# Altium project SKY32B750_OSPI_EVB1_V3.1.PrjPcb
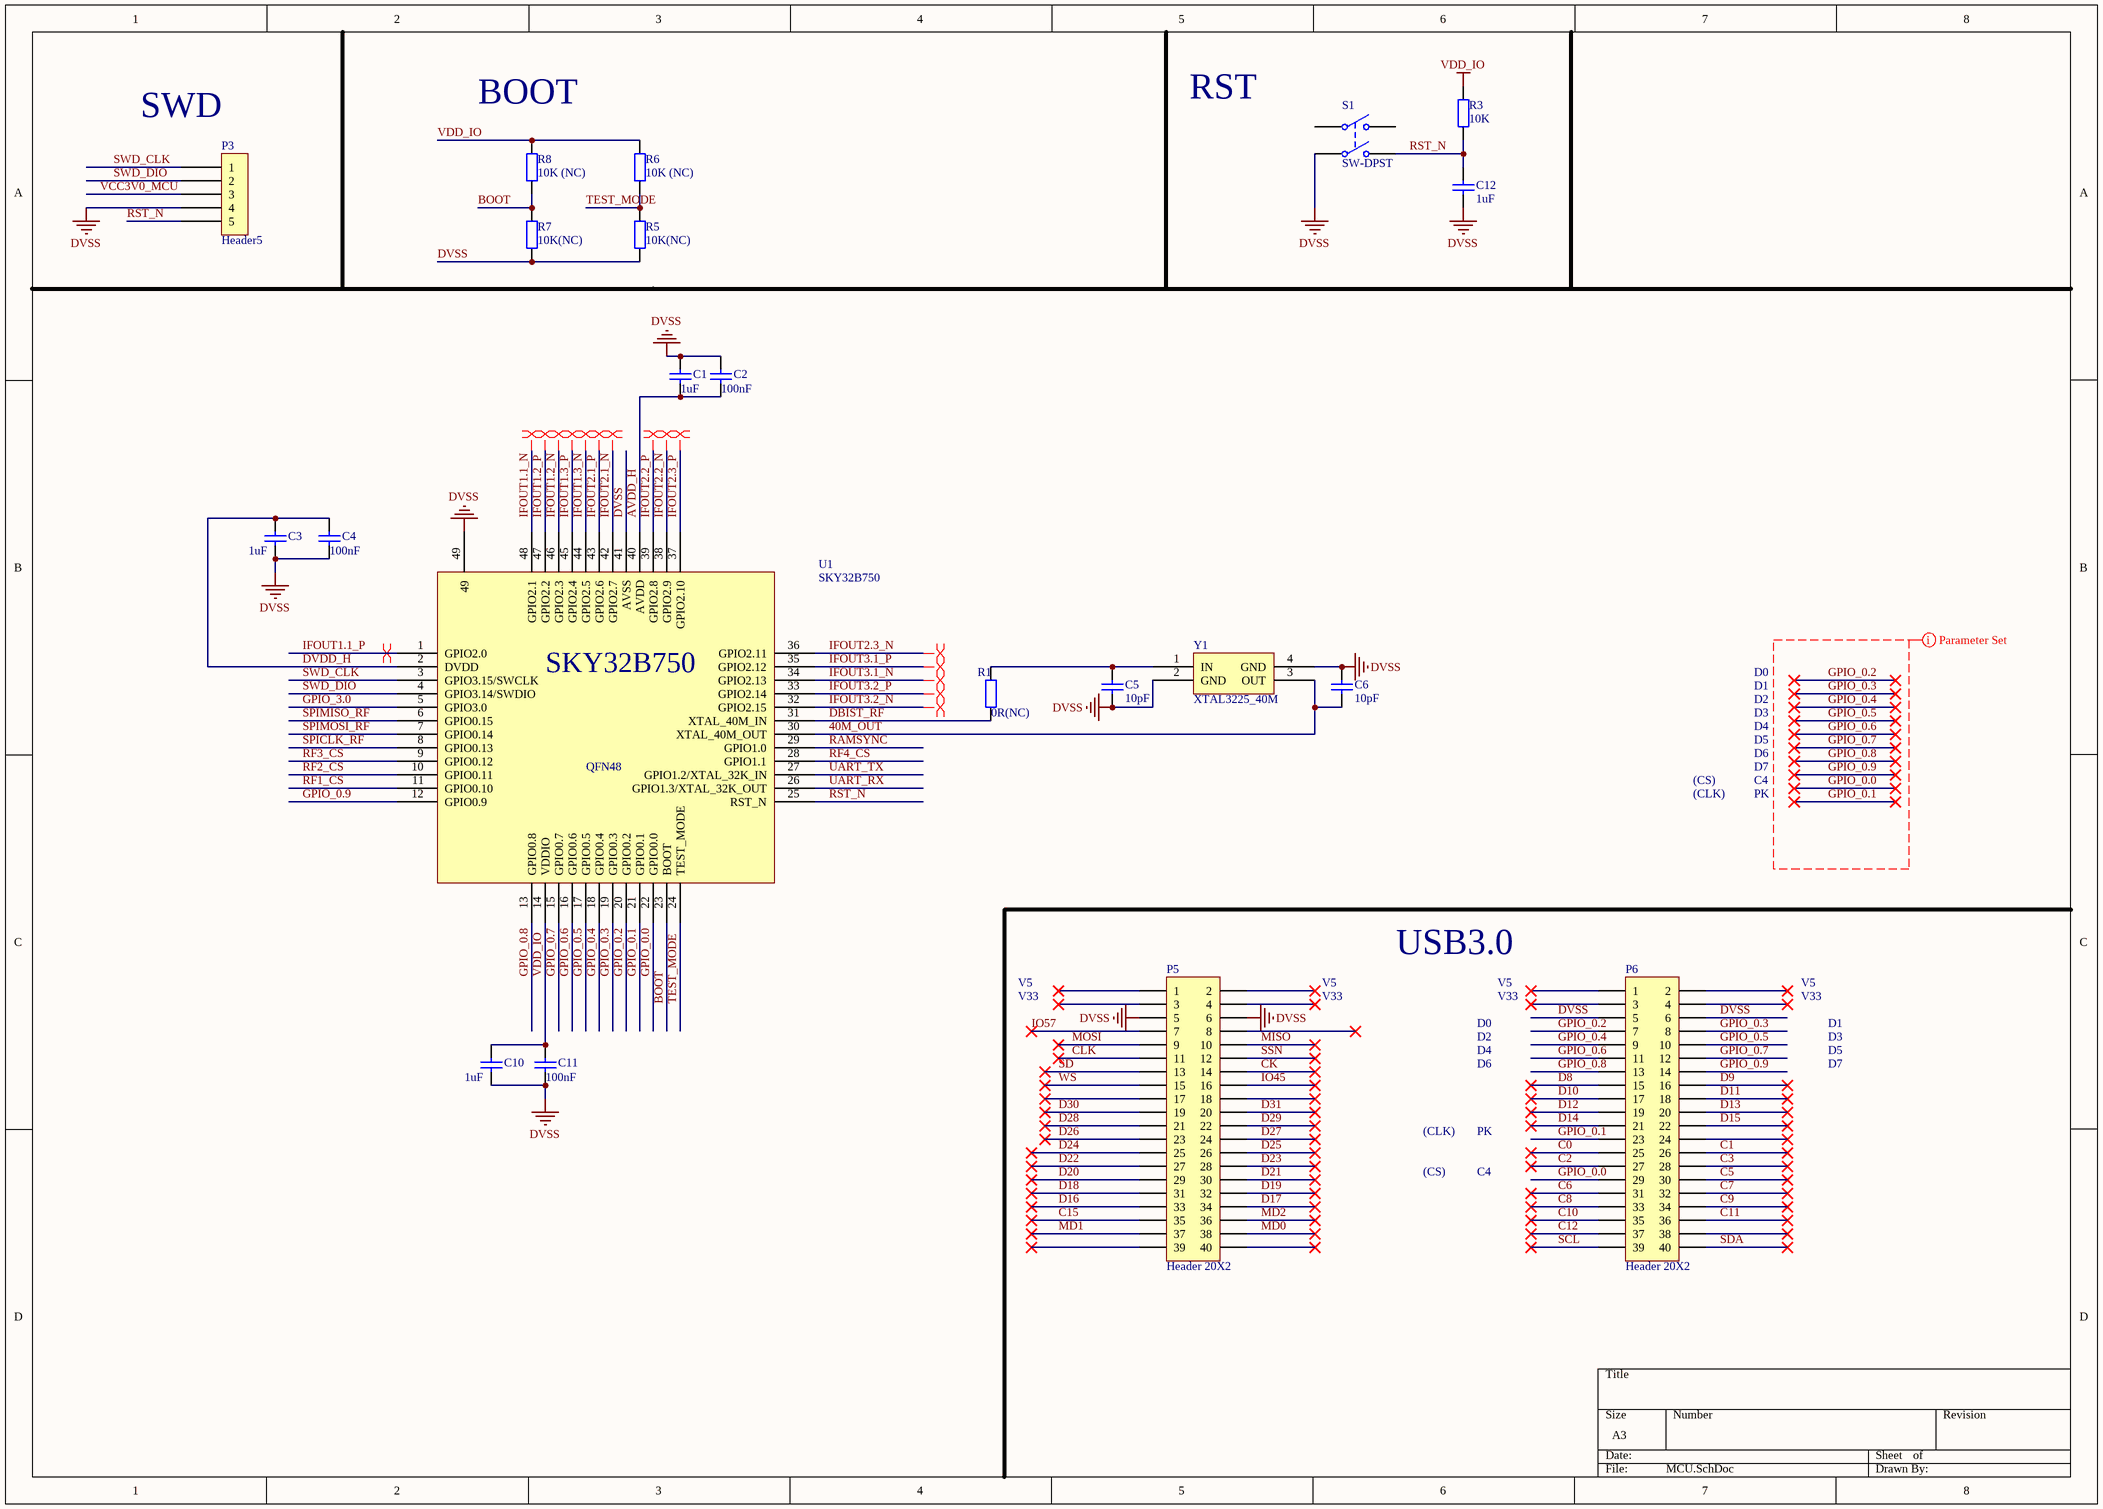
[diagram p0: MCU.SchDoc]
3 sheets, 94 parts. Net scope: global (net labels, ports and power ports of the same name join across sheets).
Board file: SKY32B750_OSPI_EVB1_V3.1.PcbDoc
Sheets:
  MCU.SchDoc
  Power.SchDoc
  RF_Connect.SchDoc

## Sheet MCU.SchDoc
size A3; SheetNumber: 1; SheetTotal: 3

### Parts
C1  1uF  [R0603]
C2  100nF  [R0603]
C3  1uF  [R0603]
C4  100nF  [R0603]
C5  10pF  [R0603]
C6  10pF  [R0603]
C10  1uF  [R0603]
C11  100nF  [R0603]
C12  1uF  [R0603]
P3  Header5  [HDR1X5]
P5  Header 20X2  [2X20_2_54_SMD]
P6  Header 20X2  [2X20_2_54_SMD]
R1  0R(NC)  [R0603]
R3  10K  [R0603]
R5  10K(NC)  [R0603]
R6  10K (NC)  [R0603]
R7  10K(NC)  [R0603]
R8  10K (NC)  [R0603]
S1  SW-DPST  [sw]
U1  SKY32B750  [QFN48]
Y1  XTAL3225_40M  [XTAL-3225]

### Nets
DVSS: C1.2 C2.2 C3.1 C4.1 C5.2 C6.1 C10.1 C11.1 C12.1 P3.4 P5.5 P5.6 P6.5 P6.6 R5.2 R7.2 S1.3(COMMON2) U1.41(AVSS) U1.49 Y1.2(GND) Y1.4(GND)
VCC3V0_MCU: P3.3
VDD_IO: C10.2 C11.2 R3.2 R6.1 R8.1 U1.14(VDDIO)
40M_OUT: C6.2 U1.30(XTAL_40M_OUT) Y1.3(OUT)
AVDD_H: C1.1 C2.1 U1.40(AVDD)
BOOT: R7.1 R8.2 U1.23(BOOT)
C0: P6.25
C1: P6.26
C2: P6.27
C3: P6.28
C5: P6.30
C6: P6.31
C7: P6.32
C8: P6.33
C9: P6.34
C10: P6.35
C11: P6.36
C12: P6.37
C15: P5.35
CK: P5.14
CLK: P5.11
D8: P6.15
D9: P6.16
D10: P6.17
D11: P6.18
D12: P6.19
D13: P6.20
D14: P6.21
D15: P6.22
D16: P5.33
D17: P5.34
D18: P5.31
D19: P5.32
D20: P5.29
D21: P5.30
D22: P5.27
D23: P5.28
D24: P5.25
D25: P5.26
D26: P5.23
D27: P5.24
D28: P5.21
D29: P5.22
D30: P5.19
D31: P5.20
DBIST_RF: R1.1 U1.31(XTAL_40M_IN)
DVDD_H: C3.2 C4.2 U1.2(DVDD)
GPIO_0.0: P6.29 U1.22(GPIO0.0)
GPIO_0.1: P6.23 U1.21(GPIO0.1)
GPIO_0.2: P6.7 U1.20(GPIO0.2)
GPIO_0.3: P6.8 U1.19(GPIO0.3)
GPIO_0.4: P6.9 U1.18(GPIO0.4)
GPIO_0.5: P6.10 U1.17(GPIO0.5)
GPIO_0.6: P6.11 U1.16(GPIO0.6)
GPIO_0.7: P6.12 U1.15(GPIO0.7)
GPIO_0.8: P6.13 U1.13(GPIO0.8)
GPIO_0.9: P6.14 U1.12(GPIO0.9)
GPIO_3.0: U1.5(GPIO3.0)
IFOUT1.1_N: U1.48(GPIO2.1)
IFOUT1.1_P: U1.1(GPIO2.0)
IFOUT1.2_N: U1.46(GPIO2.3)
IFOUT1.2_P: U1.47(GPIO2.2)
IFOUT1.3_N: U1.44(GPIO2.5)
IFOUT1.3_P: U1.45(GPIO2.4)
IFOUT2.1_N: U1.42(GPIO2.7)
IFOUT2.1_P: U1.43(GPIO2.6)
IFOUT2.2_N: U1.38(GPIO2.9)
IFOUT2.2_P: U1.39(GPIO2.8)
IFOUT2.3_N: U1.36(GPIO2.11)
IFOUT2.3_P: U1.37(GPIO2.10)
IFOUT3.1_N: U1.34(GPIO2.13)
IFOUT3.1_P: U1.35(GPIO2.12)
IFOUT3.2_N: U1.32(GPIO2.15)
IFOUT3.2_P: U1.33(GPIO2.14)
IO45: P5.16
IO57: P5.7
MD0: P5.38
MD1: P5.37
MD2: P5.36
MISO: P5.10
MOSI: P5.9
RAMSYNC: U1.29(GPIO1.0)
RF1_CS: U1.11(GPIO0.10)
RF2_CS: U1.10(GPIO0.11)
RF3_CS: U1.9(GPIO0.12)
RF4_CS: U1.28(GPIO1.1)
RST_N: C12.2 P3.5 R3.1 S1.4(NO2) U1.25(RST_N)
SCL: P6.39
SD: P5.13
SDA: P6.40
SPICLK_RF: U1.8(GPIO0.13)
SPIMISO_RF: U1.6(GPIO0.15)
SPIMOSI_RF: U1.7(GPIO0.14)
SSN: P5.12
SWD_CLK: P3.1 U1.3(GPIO3.15/SWCLK)
SWD_DIO: P3.2 U1.4(GPIO3.14/SWDIO)
TEST_MODE: R5.1 R6.2 U1.24(TEST_MODE)
UART_RX: U1.26(GPIO1.3/XTAL_32K_OUT)
UART_TX: U1.27(GPIO1.2/XTAL_32K_IN)
WS: P5.15
NetC5_1: C5.1 R1.2 Y1.1(IN)

Not connected (* = marked no-connect by the designer): P5 1* 2* 3* 4* 8* 17* 18* 39* 40*; P6 1* 2* 3* 4* 24* 38*; S1 1(COMMON1) 2(NO1)

### Layout directives
differential pair: IFOUT1.1_N, IFOUT1.1_P, IFOUT1.2_N, IFOUT1.2_P, IFOUT1.3_N, IFOUT1.3_P, IFOUT2.1_N, IFOUT2.1_P, IFOUT2.2_N, IFOUT2.2_P, IFOUT2.3_N, IFOUT2.3_P, IFOUT3.1_N, IFOUT3.1_P, IFOUT3.2_N, IFOUT3.2_P
net class OSPI: GPIO_0.0, GPIO_0.1, GPIO_0.2, GPIO_0.3, GPIO_0.4, GPIO_0.5, GPIO_0.6, GPIO_0.7, GPIO_0.8, GPIO_0.9

### Notes on the sheet
- (near R8) BOOT
- RST
- (near P3) SWD
- D0
- D1
- D2
- D3
- (CS)
- D4
- D5
- D6
- D7
- C4
- (CLK)
- PK
- V5
- USB3.0
- V33
- (in symbol SYK32B750) QFN48

### Library data of the parts
C1-C4 C10 C11 = Cap: CAP, CERM, 4.7nF, 100 V, +/- 5%, X7R, 0603; Value: 100pF; Published: 8-Jun-2000; LatestRevisionDate: 17-Jul-2002; LatestRevisionNote: Re-released for DXP Platform.; PackageReference: RAD-0.3; Publisher: Altium Limited
C5 C6 C12 = Cap: Capacitor; Published: 8-Jun-2000; LatestRevisionDate: 17-Jul-2002; LatestRevisionNote: Re-released for DXP Platform.; PackageReference: RAD-0.3; Publisher: Altium Limited; PackageDescription: Radial Cap, Thru-Hole; 2 Leads; 0.3 in Pin Spacing
  C5 C6: Value: 10pF
  C12: Value: 1uF
P5 P6 = Header 20X2: Header, 20-Pin, Dual row; LatestRevisionDate: 17-Jul-2002; LatestRevisionNote: Re-released for DXP Platform.; Publisher: Altium Limited
R1 R3 = Res2: Resistor; Published: 8-Jun-2000; LatestRevisionDate: 17-Jul-2002; LatestRevisionNote: Re-released for DXP Platform.; PackageReference: AXIAL-0.4; Publisher: Altium Limited; PackageDescription: Axial Device, Thru-Hole; 2 Leads; 0.4 in Pin Spacing
  R1: Value: 0R
  R3: Value: 10K
R5-R8 = Res2: Resistor; Value: 0R; Published: 8-Jun-2000; LatestRevisionDate: 17-Jul-2002; LatestRevisionNote: Re-released for DXP Platform.; PackageReference: AXIAL-0.4; Publisher: Altium Limited; PackageDescription: Axial Device, Thru-Hole; 2 Leads; 0.4 in Pin Spacing
S1 = SW-DPST: Double-Pole, Single-Throw Switch; Published: 24-Mar-1999; LatestRevisionDate: 17-Jul-2002; LatestRevisionNote: Re-released for DXP Platform.; PackageReference: DPST-4; Publisher: Altium Limited; PackageDescription: Switch; 4 Leads
U1 = SYK32B750
Y1 = XTAL3225

## Sheet Power.SchDoc
size A4; SheetNumber: 2; SheetTotal: 3
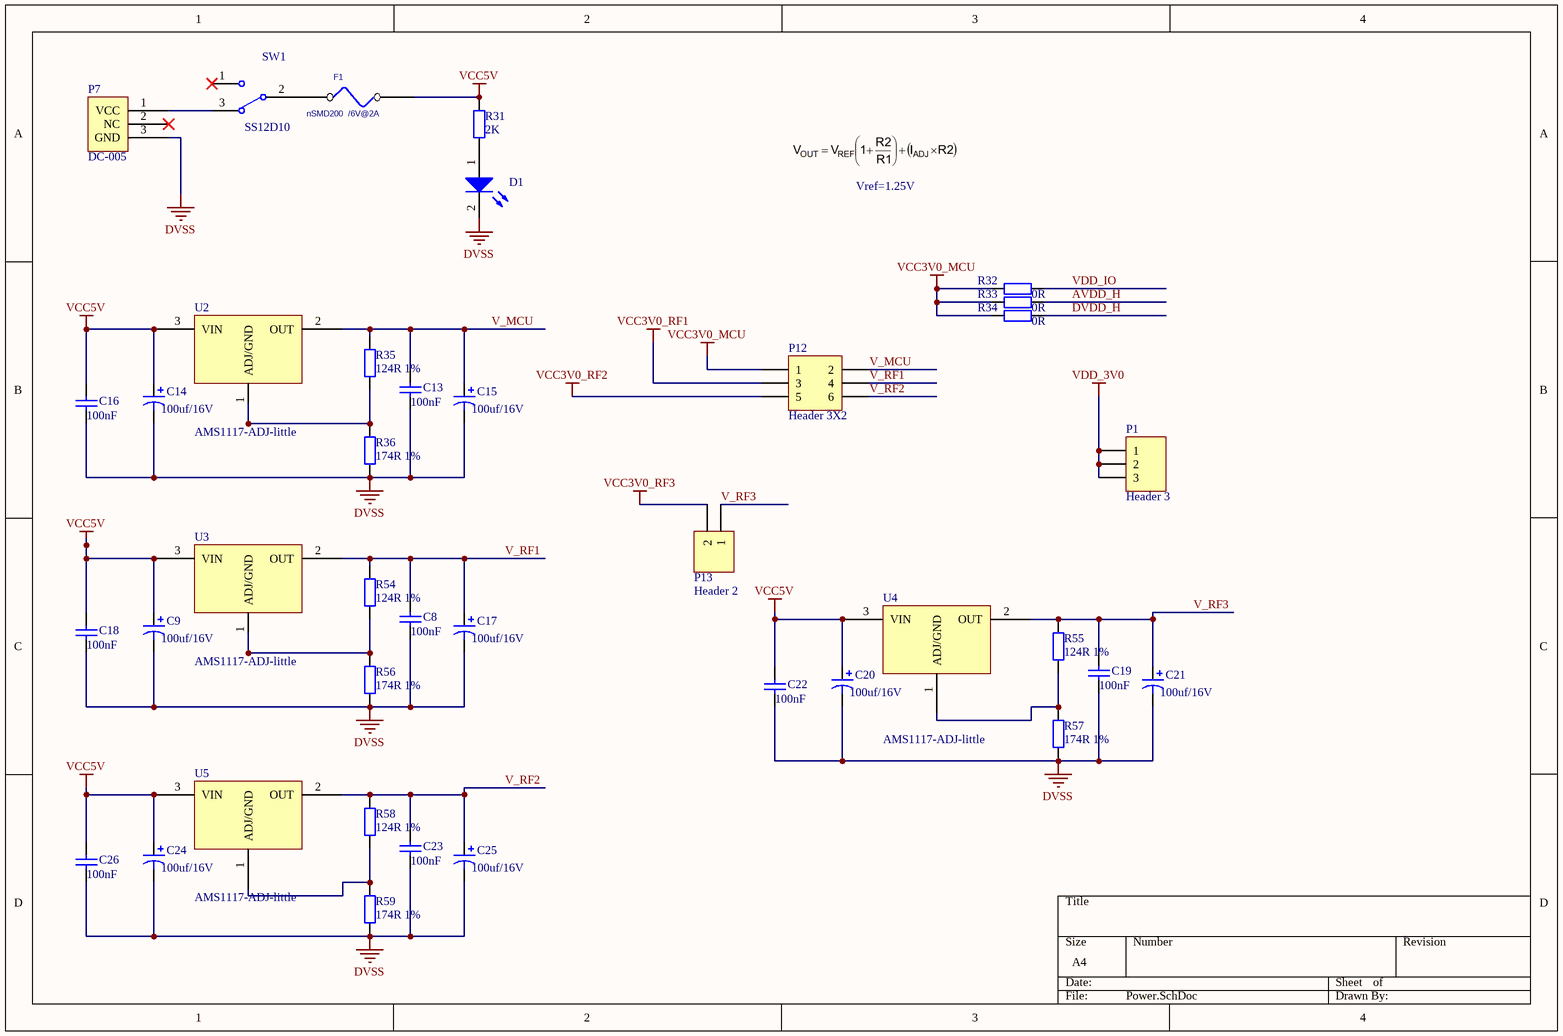
[diagram p1: Power.SchDoc]

### Parts
C8  100nF  [R0603]
C9  100uf/16V  [TAN3528]
C13  100nF  [R0603]
C14  100uf/16V  [TAN3528]
C15  100uf/16V  [TAN3528]
C16  100nF  [R0603]
C17  100uf/16V  [TAN3528]
C18  100nF  [R0603]
C19  100nF  [R0603]
C20  100uf/16V  [TAN3528]
C21  100uf/16V  [TAN3528]
C22  100nF  [R0603]
C23  100nF  [R0603]
C24  100uf/16V  [TAN3528]
C25  100uf/16V  [TAN3528]
C26  100nF  [R0603]
D1  LED_Red  [0603d]  (value not drawn)
F1  nSMD200  /6V@2A  [FN1812]
P1  Header 3  [HDR1X3]
P7  DC-005  [DC005]
P12  Header 3X2  [HDR2X3]
P13  Header 2  [HDR1X2]
R31  2K  [R0603]
R32  0R  [R0603]
R33  0R  [R0603]
R34  0R  [R0603]
R35  124R 1%  [R0603]
R36  174R 1%  [R0603]
R54  124R 1%  [R0603]
R55  124R 1%  [R0603]
R56  174R 1%  [R0603]
R57  174R 1%  [R0603]
R58  124R 1%  [R0603]
R59  174R 1%  [R0603]
SW1  SS12D10  [SW123]
U2  AMS1117-ADJ-little  [LDO-SOT-89-3]
U3  AMS1117-ADJ-little  [LDO-SOT-89-3]
U4  AMS1117-ADJ-little  [LDO-SOT-89-3]
U5  AMS1117-ADJ-little  [LDO-SOT-89-3]

### Nets
DVSS: C8.1 C9.2 C13.1 C14.2 C15.2 C16.1 C17.2 C18.1 C19.1 C20.2 C21.2 C22.1 C23.1 C24.2 C25.2 C26.1 D1.2(K) P7.3(GND) R36.1 R56.1 R57.1 R59.1
VCC3V0_MCU: P12.1 R32.1 R33.1 R34.1
VCC3V0_RF1: P12.3
VCC3V0_RF2: P12.5
VCC3V0_RF3: P13.2
VCC5V: C9.1 C14.1 C16.2 C18.2 C20.1 C22.2 C24.1 C26.2 F1.2 R31.1 U2.3(VIN) U3.3(VIN) U4.3(VIN) U5.3(VIN)
VDD_3V0: P1.1 P1.2 P1.3
VDD_IO: R32.2
AVDD_H: R33.2
DVDD_H: R34.2
V_MCU: C13.2 C15.1 P12.2 R35.2 U2.2(OUT)
V_RF1: C8.2 C17.1 P12.4 R54.2 U3.2(OUT)
V_RF2: C23.2 C25.1 P12.6 R58.2 U5.2(OUT)
V_RF3: C19.2 C21.1 P13.1 R55.2 U4.2(OUT)
NetD1_1: D1.1(A) R31.2
NetF1_1: F1.1 SW1.2
NetP7_1: P7.1(VCC) SW1.3
NetR35_1: R35.1 R36.2 U2.1(ADJ/GND)
NetR54_1: R54.1 R56.2 U3.1(ADJ/GND)
NetR55_1: R55.1 R57.2 U4.1(ADJ/GND)
NetR58_1: R58.1 R59.2 U5.1(ADJ/GND)

Not connected (* = marked no-connect by the designer): P7 2(NC)*; SW1 1*

### Notes on the sheet
- Vref=1.25V

### Library data of the parts
C8 C13 C16 C18 C19 C22 C23 C26 = Cap: Value: 100pF; Published: 8-Jun-2000; LatestRevisionDate: 17-Jul-2002; LatestRevisionNote: Re-released for DXP Platform.; PackageReference: RAD-0.3; Publisher: Altium Limited
C9 C14 C15 C17 C20 C21 C24 C25 = Cap Pol1: tan3528 100uf/16V; Value: 100pF; Published: 8-Jun-2000; LatestRevisionDate: 17-Jul-2002; LatestRevisionNote: Re-released for DXP Platform.; PackageReference: RB7.6-15; Publisher: Altium Limited; PackageDescription: Polarized Capacitor (Radial); 2 Leads
D1 = LED2: Typical RED, GREEN, YELLOW, AMBER GaAs LED; Manufacturer: Generic Components; Class: Optoelectronic; Published: 08/06/2000; Publisher: Altium Hobart Technology Centre; SubClass: LED
F1 = FUSE: MFR_PN: 0603L100SLYR; MFR_Name: LITTELFUSE
P1 = Header 3: Header, 3-Pin; LatestRevisionDate: 17-Jul-2002; LatestRevisionNote: Re-released for DXP Platform.; Publisher: Altium Limited
P13 = Header 2: 2.54mm直插针,2P; LatestRevisionDate: 17-Jul-2002; LatestRevisionNote: Re-released for DXP Platform.; Publisher: Altium Limited
R31-R34 = Res2: Resistor; Manufacturer: Generic Components; Class: Passive; Value: 2.2K; Published: 08/06/2000; Publisher: Altium Hobart Technology Centre; SubClass: Resistor
R35 R36 R54-R59 = Res2: Value: 1K; Published: 8-Jun-2000; LatestRevisionDate: 17-Jul-2002; LatestRevisionNote: Re-released for DXP Platform.; PackageReference: AXIAL-0.4; Publisher: Altium Limited; PackageDescription: Axial Device, Thru-Hole; 2 Leads; 0.4 in Pin Spacing
SW1 = SW123
U2 = AMS1117-ADJ-little: AMS1117-ADJ-little ,SOT-89-3
U3-U5 = AMS1117-ADJ-little: AMS1117-ADJ-little,SOT-89-3

## Sheet RF_Connect.SchDoc
size A3; SheetNumber: 3; SheetTotal: 3
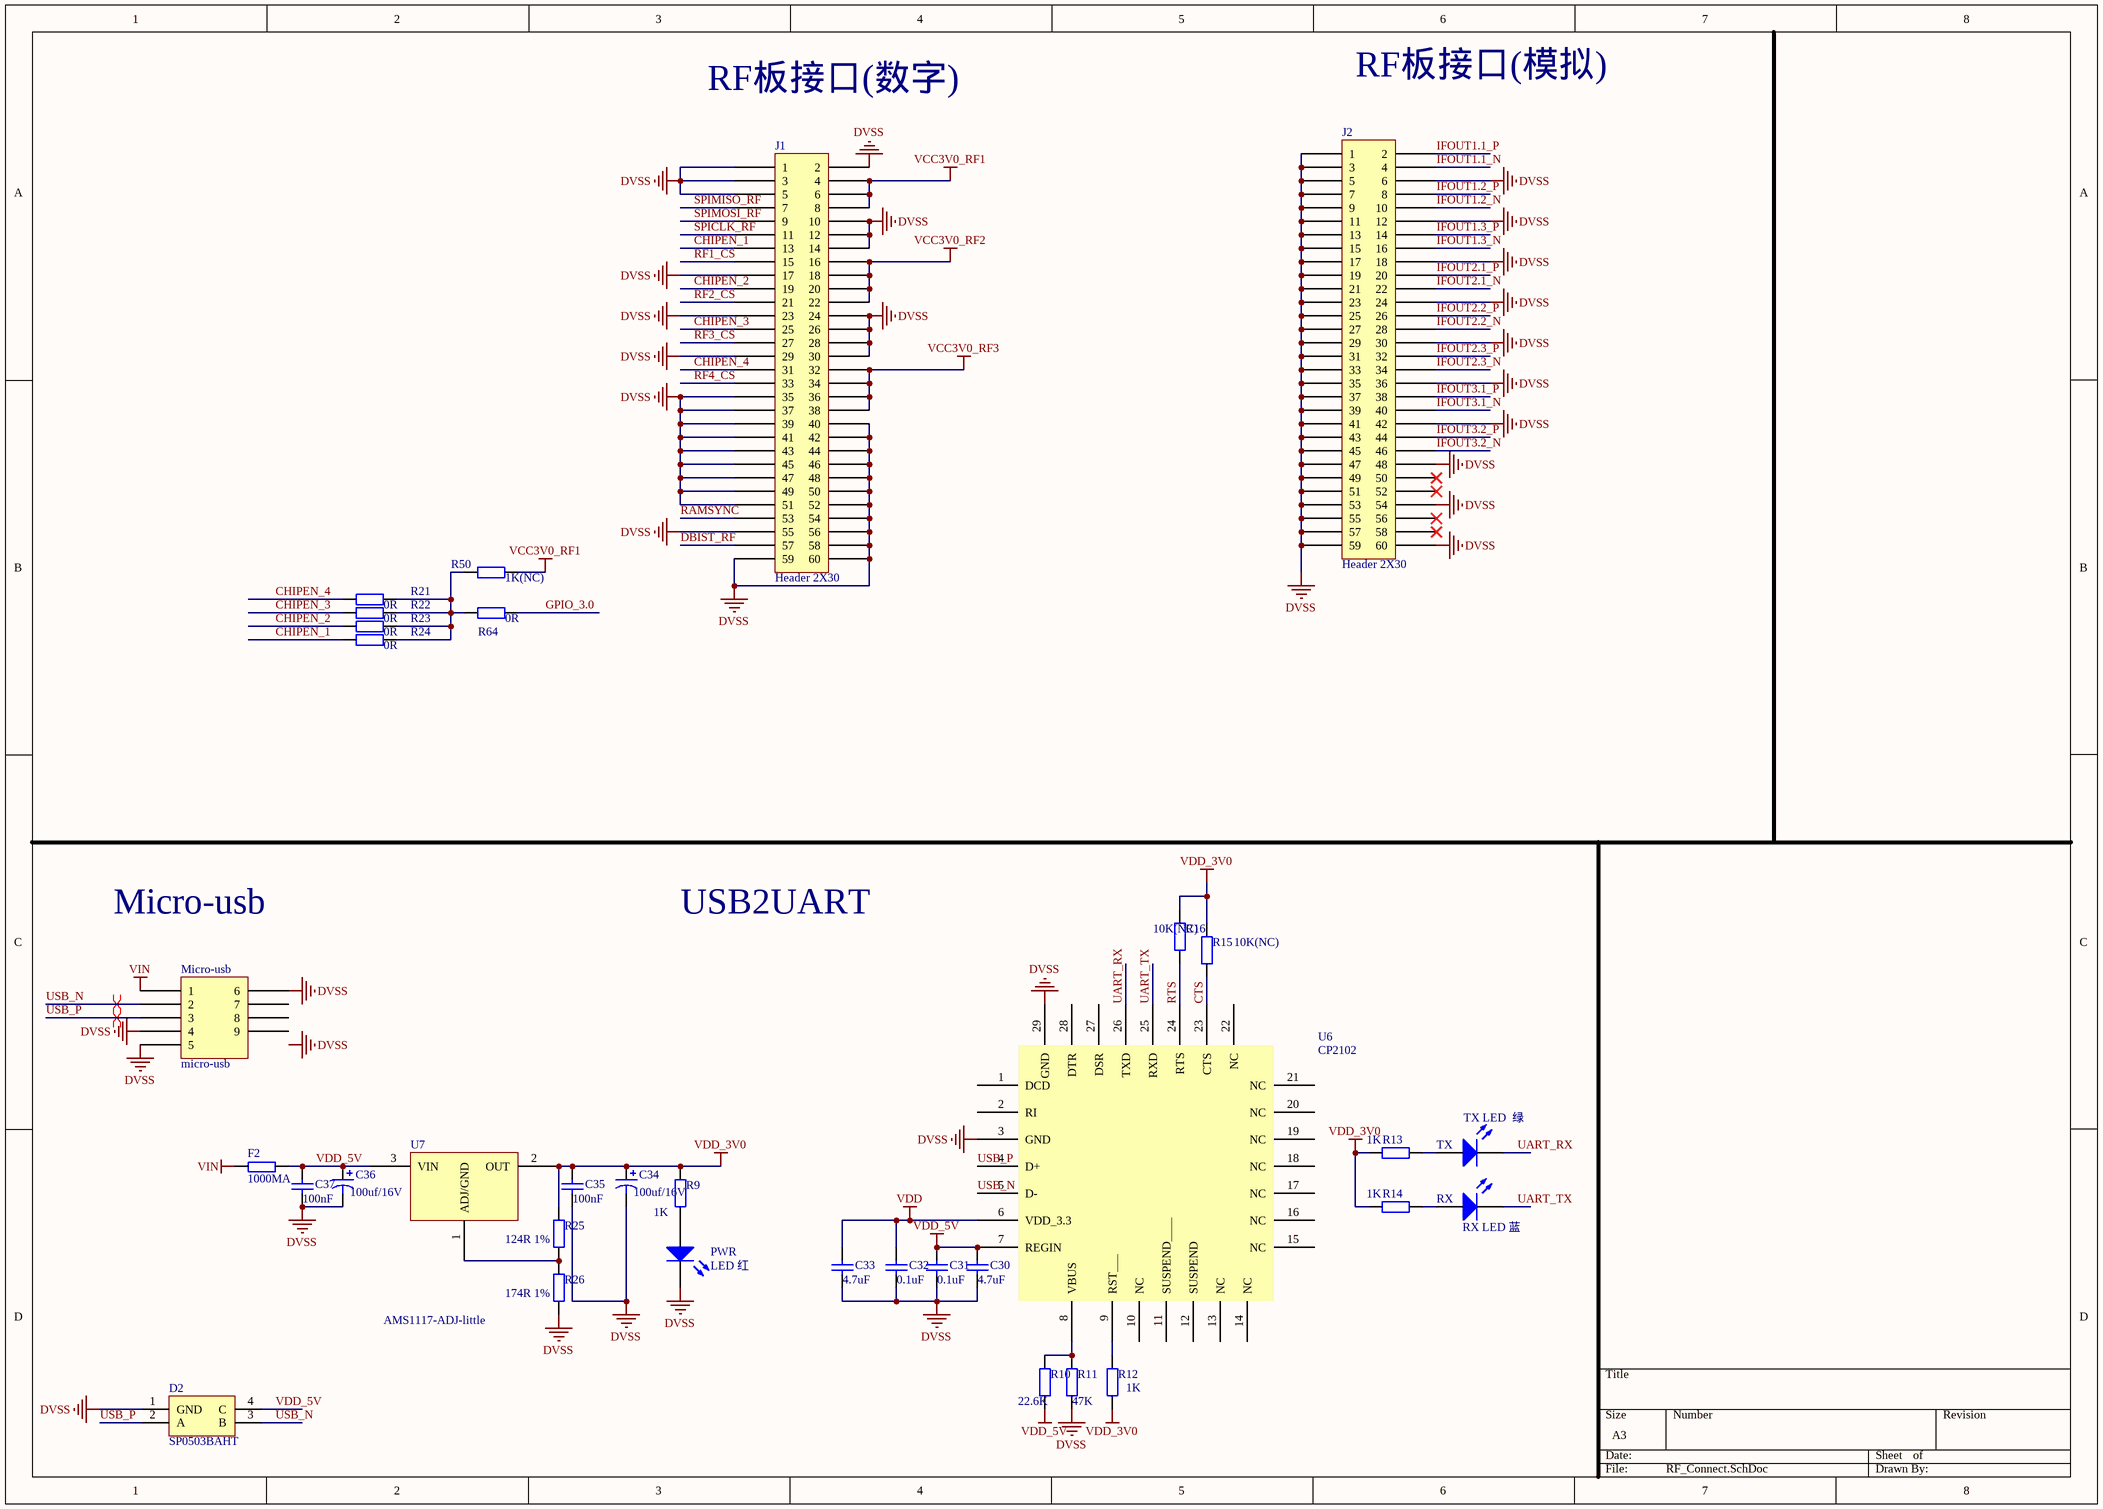
[diagram p2: RF_Connect.SchDoc]

### Parts
C30  4.7uF  [R0603]
C31  0.1uF  [R0603]
C32  0.1uF  [R0603]
C33  4.7uF  [R0603]
C34  100uf/16V  [TAN3528]
C35  100nF  [R0603]
C36  100uf/16V  [TAN3528]
C37  100nF  [R0603]
D2  SP0503BAHT  [SOT143]
F2  1000MA  [0805]
J1  Header 2X30  [60pin_0.8mm]
J2  Header 2X30  [60pin_0.8mm]
Micro-usb  micro-usb  [Micro-B]
PWR  LED 红  [LC-0603_LED_S4]
R9  1K  [R0603]
R10  22.6K  [R0603]
R11  47K  [R0603]
R12  1K  [R0603]
R13  1K  [R0603]
R14  1K  [R0603]
R15  10K(NC)  [R0603]
R16  10K(NC)  [R0603]
R21  0R  [R0603]
R22  0R  [R0603]
R23  0R  [R0603]
R24  0R  [R0603]
R25  124R 1%  [R0603]
R26  174R 1%  [R0603]
R50  1K(NC)  [R0603]
R64  0R  [R0603]
RX  RX LED 蓝  [LC-0603_LED_S4]
TX  TX LED  绿  [LC-0603_LED_S4]
U6  CP2102  [QFN28N5X5P0.5E3.35]
U7  AMS1117-ADJ-little  [LDO-SOT-89-3]

### Nets
DVSS: C30.2 C31.2 C32.2 C33.2 C34.2 C35.1 C36.2 C37.1 D2.1(GND) J1.1 J1.2 J1.3 J1.5 J1.10 J1.12 J1.14 J1.17 J1.23 J1.24 J1.26 J1.28 J1.29 J1.30 J1.35 J1.37 J1.39 J1.40 J1.41 J1.42 J1.43 J1.44 J1.45 J1.46 J1.47 J1.48 J1.49 J1.50 J1.51 J1.52 J1.54 J1.55 J1.56 J1.58 J1.59 J1.60 J2.1 J2.3 J2.5 J2.6 J2.7 J2.9 J2.11 J2.12 J2.13 J2.15 J2.17 J2.18 J2.19 J2.21 J2.23 J2.24 J2.25 J2.27 J2.29 J2.30 J2.31 J2.33 J2.35 J2.36 J2.37 J2.39 J2.41 J2.42 J2.43 J2.45 J2.47 J2.48 J2.49 J2.51 J2.53 J2.54 J2.55 J2.57 J2.59 J2.60 Micro-usb.4 Micro-usb.5 Micro-usb.6 PWR.2(K) R11.2 R26.1 U6.3(GND) U6.29(GND)
VCC3V0_RF1: J1.4 J1.6 J1.8 R50.2
VCC3V0_RF2: J1.16 J1.18 J1.20 J1.22
VCC3V0_RF3: J1.32 J1.34 J1.36 J1.38
VDD: C32.1 C33.1 U6.6(VDD_3.3)
VDD_3V0: C34.1 C35.2 R9.1 R12.2 R13.2 R14.2 R15.1 R16.1 R25.2 U7.2(OUT)
VDD_5V: C30.1 C31.1 C36.1 C37.2 D2.4(C) F2.2 R10.2 U6.7(REGIN) U7.3(VIN)
VIN: F2.1 Micro-usb.1
CHIPEN_1: J1.13 R24.1
CHIPEN_2: J1.19 R23.1
CHIPEN_3: J1.25 R22.1
CHIPEN_4: J1.31 R21.1
CTS: R15.2 U6.23(CTS)
DBIST_RF: J1.57
GPIO_3.0: R64.2
IFOUT1.1_N: J2.4
IFOUT1.1_P: J2.2
IFOUT1.2_N: J2.10
IFOUT1.2_P: J2.8
IFOUT1.3_N: J2.16
IFOUT1.3_P: J2.14
IFOUT2.1_N: J2.22
IFOUT2.1_P: J2.20
IFOUT2.2_N: J2.28
IFOUT2.2_P: J2.26
IFOUT2.3_N: J2.34
IFOUT2.3_P: J2.32
IFOUT3.1_N: J2.40
IFOUT3.1_P: J2.38
IFOUT3.2_N: J2.46
IFOUT3.2_P: J2.44
RAMSYNC: J1.53
RF1_CS: J1.15
RF2_CS: J1.21
RF3_CS: J1.27
RF4_CS: J1.33
RTS: R16.2 U6.24(RTS)
SPICLK_RF: J1.11
SPIMISO_RF: J1.7
SPIMOSI_RF: J1.9
UART_RX: TX.2(K) U6.26(TXD)
UART_TX: RX.2(K) U6.25(RXD)
USB_N: D2.3(B) Micro-usb.2 U6.5(D-)
USB_P: D2.2(A) Micro-usb.3 U6.4(D+)
NetPWR_1: PWR.1(A) R9.2
NetR10_1: R10.1 R11.1 U6.8(VBUS)
NetR12_1: R12.1 U6.9(RST___)
NetR13_1: R13.1 TX.1(A)
NetR14_1: R14.1 RX.1(A)
NetR21_2: R21.2 R22.2 R23.2 R24.2 R50.1 R64.1
NetR25_1: R25.1 R26.2 U7.1(ADJ/GND)

Not connected (* = marked no-connect by the designer): J2 50* 52* 56* 58*; Micro-usb 7 8 9; U6 1(DCD) 2(RI) 10(NC) 11(SUSPEND____) 12(SUSPEND) 13(NC) 14(NC) 15(NC) 16(NC) 17(NC) 18(NC) 19(NC) 20(NC) 21(NC) 22(NC) 27(DSR) 28(DTR)

### Layout directives
differential pair: USB_N, USB_P

### Notes on the sheet
- RF板接口(数字)
- RF板接口(模拟)
- Micro-usb
- USB2UART
- Labels drawn without touching a wire or pin: DVSS

### Library data of the parts
C30-C33 = Cap: 表贴电容; Value: 1uF; Published: 8-Jun-2000; LatestRevisionDate: 17-Jul-2002; LatestRevisionNote: Re-released for DXP Platform.; PackageReference: RAD-0.3; Publisher: Altium Limited
C34 C36 = Cap Pol1: tan3528 100uf/16V; Value: 100pF; Published: 8-Jun-2000; LatestRevisionDate: 17-Jul-2002; LatestRevisionNote: Re-released for DXP Platform.; PackageReference: RB7.6-15; Publisher: Altium Limited; PackageDescription: Polarized Capacitor (Radial); 2 Leads
C35 C37 = Cap: Value: 100pF; Published: 8-Jun-2000; LatestRevisionDate: 17-Jul-2002; LatestRevisionNote: Re-released for DXP Platform.; PackageReference: RAD-0.3; Publisher: Altium Limited
D2 = SP0503BAHT: 表贴芯片
F2 = R_1: 表贴保险
J1 J2 = Header 2X30: 2x30 ， 60P， 0.8mm ，立贴 ，母
Micro-usb = Micro-B
PWR RX TX = LED-SMT: 表贴LED管
R9 R12-R14 = Res2: 表贴电阻; Published: 8-Jun-2000; LatestRevisionDate: 17-Jul-2002; LatestRevisionNote: Re-released for DXP Platform.; PackageReference: AXIAL-0.4; Publisher: Altium Limited; Value: 1K
R10 R11 R15 R16 = Res2: 表贴电阻; Value: 1K; Published: 8-Jun-2000; LatestRevisionDate: 17-Jul-2002; LatestRevisionNote: Re-released for DXP Platform.; PackageReference: AXIAL-0.4; Publisher: Altium Limited
R21-R24 R50 R64 = Res2: as R31 on sheet Power; Published: 08/06/2000; Publisher: Altium Hobart Technology Centre; SubClass: Resistor
R25 R26 = Res2: Value: 1K; Published: 8-Jun-2000; LatestRevisionDate: 17-Jul-2002; LatestRevisionNote: Re-released for DXP Platform.; PackageReference: AXIAL-0.4; Publisher: Altium Limited; PackageDescription: Axial Device, Thru-Hole; 2 Leads; 0.4 in Pin Spacing
U6 = Component_2: 表贴芯片
U7 = AMS1117-ADJ-little: AMS1117-ADJ-little ，SOT-89-3

## Nets that join several sheets
DVSS: MCU (21 pins), Power (22 pins), RF_Connect (93 pins)
VCC3V0_MCU: MCU (P3.3), Power (P12.1 R32.1 R33.1 R34.1)
VCC3V0_RF1: Power (P12.3), RF_Connect (J1.4 J1.6 J1.8 R50.2)
VCC3V0_RF2: Power (P12.5), RF_Connect (J1.16 J1.18 J1.20 J1.22)
VCC3V0_RF3: Power (P13.2), RF_Connect (J1.32 J1.34 J1.36 J1.38)
VDD_3V0: Power (P1.1 P1.2 P1.3), RF_Connect (10 pins)
VDD_IO: MCU (6 pins), Power (R32.2)
AVDD_H: MCU (C1.1 C2.1 U1.40), Power (R33.2)
DBIST_RF: MCU (R1.1 U1.31), RF_Connect (J1.57)
DVDD_H: MCU (C3.2 C4.2 U1.2), Power (R34.2)
GPIO_3.0: MCU (U1.5), RF_Connect (R64.2)
IFOUT1.1_N: MCU (U1.48), RF_Connect (J2.4)
IFOUT1.1_P: MCU (U1.1), RF_Connect (J2.2)
IFOUT1.2_N: MCU (U1.46), RF_Connect (J2.10)
IFOUT1.2_P: MCU (U1.47), RF_Connect (J2.8)
IFOUT1.3_N: MCU (U1.44), RF_Connect (J2.16)
IFOUT1.3_P: MCU (U1.45), RF_Connect (J2.14)
IFOUT2.1_N: MCU (U1.42), RF_Connect (J2.22)
IFOUT2.1_P: MCU (U1.43), RF_Connect (J2.20)
IFOUT2.2_N: MCU (U1.38), RF_Connect (J2.28)
IFOUT2.2_P: MCU (U1.39), RF_Connect (J2.26)
IFOUT2.3_N: MCU (U1.36), RF_Connect (J2.34)
IFOUT2.3_P: MCU (U1.37), RF_Connect (J2.32)
IFOUT3.1_N: MCU (U1.34), RF_Connect (J2.40)
IFOUT3.1_P: MCU (U1.35), RF_Connect (J2.38)
IFOUT3.2_N: MCU (U1.32), RF_Connect (J2.46)
IFOUT3.2_P: MCU (U1.33), RF_Connect (J2.44)
RAMSYNC: MCU (U1.29), RF_Connect (J1.53)
RF1_CS: MCU (U1.11), RF_Connect (J1.15)
RF2_CS: MCU (U1.10), RF_Connect (J1.21)
RF3_CS: MCU (U1.9), RF_Connect (J1.27)
RF4_CS: MCU (U1.28), RF_Connect (J1.33)
SPICLK_RF: MCU (U1.8), RF_Connect (J1.11)
SPIMISO_RF: MCU (U1.6), RF_Connect (J1.7)
SPIMOSI_RF: MCU (U1.7), RF_Connect (J1.9)
UART_RX: MCU (U1.26), RF_Connect (TX.2 U6.26)
UART_TX: MCU (U1.27), RF_Connect (RX.2 U6.25)